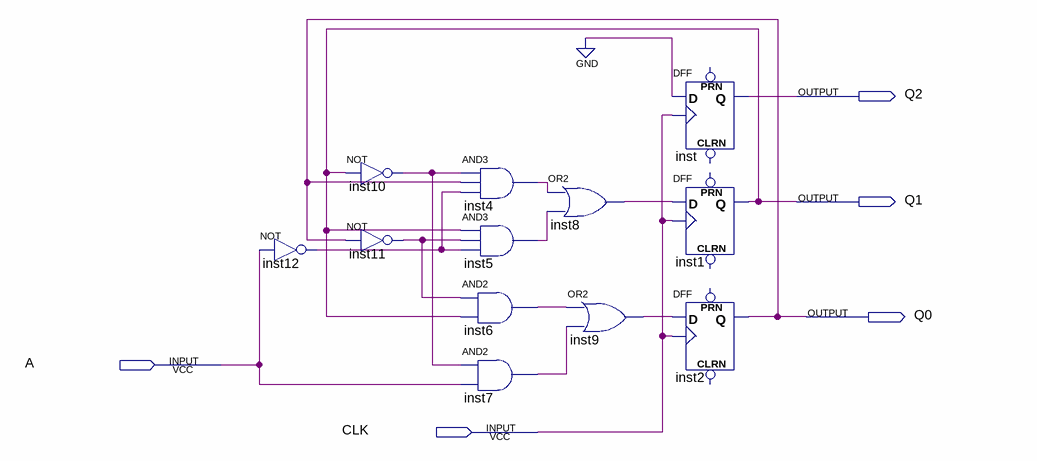
[diagram p0: schematic sheet]
// Quartus schematic 8thMe.bdf as structural Verilog: 12 symbols, 5 pins
module \8thMe  (
  input  A,
  input  CLK,
  output Q2,
  output Q1,
  output Q0
);

  wire inst4_out, inst5_out, inst6_out, inst7_out, inst8_out, inst9_out, inst10_out, inst11_out, inst12_out;

  not inst12 (inst12_out, A);
  not inst10 (inst10_out, Q1);
  not inst11 (inst11_out, Q0);
  and inst4 (inst4_out, inst10_out, Q0, inst12_out);
  and inst5 (inst5_out, Q1, inst11_out, inst12_out);
  and inst6 (inst6_out, inst11_out, Q1);
  and inst7 (inst7_out, inst10_out, A);
  or inst8 (inst8_out, inst4_out, inst5_out);
  or inst9 (inst9_out, inst6_out, inst7_out);
  DFF inst (.CLK(CLK), .D(1'b0), .Q(Q2));  // open: CLRN, PRN
  DFF inst1 (.CLK(CLK), .D(inst8_out), .Q(Q1));  // open: CLRN, PRN
  DFF inst2 (.CLK(CLK), .D(inst9_out), .Q(Q0));  // open: CLRN, PRN
endmodule
